# EAGLE design untitled (EAGLE 6.4)
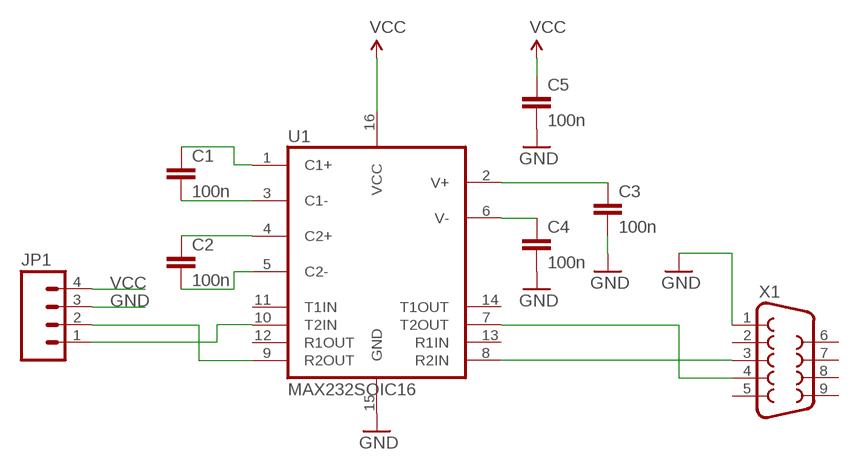
[diagram p0: schematic, sheet 1]

## Parts
C1  100n  CAP1206  [1206]
C2  100n  CAP1206  [1206]
C3  100n  CAP1206  [1206]
C4  100n  CAP1206  [1206]
C5  100n  CAP1206  [1206]
JP1  M04PTH  [1X04]
U1  MAX232SOIC16  [SO016]
X1  DB9FEMALE  [DB9]

## Nets
GND: C3.2 C4.2 C5.2 JP1.3 U1.15(GND) X1.1
N$1: C1.1 U1.1(C1+)
N$2: C1.2 U1.3(C1-)
N$3: C2.1 U1.4(C2+)
N$4: C2.2 U1.5(C2-)
N$5: C3.1 U1.2(V+)
N$6: C4.1 U1.6(V-)
N$7: U1.8(R2IN) X1.3
N$8: U1.7(T2OUT) X1.4
N$9: JP1.2 U1.9(R2OUT)
N$10: JP1.1 U1.10(T2IN)
VCC: C5.1 JP1.4 U1.16(VCC)
Unconnected: U1.11(T1IN) U1.12(R1OUT) U1.13(R1IN) U1.14(T1OUT) X1.2 X1.5 X1.6 X1.7 X1.8 X1.9

## Library data of the parts
C1-C5 = SparkFun-Capacitors:CAP: Capacitor Standard 0603 ceramic capacitor, and 0.1" leaded capacitor.
JP1 = SparkFun-Connectors:M04: Header 4 Standard 4-pin 0.1" header. Use with straight break away headers (SKU : PRT-00116), right angle break away headers (PRT-00553), swiss pins (PRT-00743), machine pins (PRT-00117), and female headers (PRT-00115). Molex polarized connector foot print use with SKU : PRT-08231 with associated crimp pins and housings. 1MM SMD Version SKU: PRT-10208
U1 = SparkFun-DigitalIC:MAX232: RS232 Transceiver Very common IC. This is generically called 'MAX232', but works with the 3V equivalent MAX3232 generic ICs. Field tested and mother approved. Spark Fun Electronics SKU : COM-00316 (DIP) and COM-00589 (SMD)
X1 = SparkFun-Connectors:DB9: DB9 Connector Standard DB9 (D-Sub 9) serial connector. Can be used for CAN bus as well as RS485 and RS232. Footprint production proven. Spark Fun Electronics SKU : PRT-00429

## Board
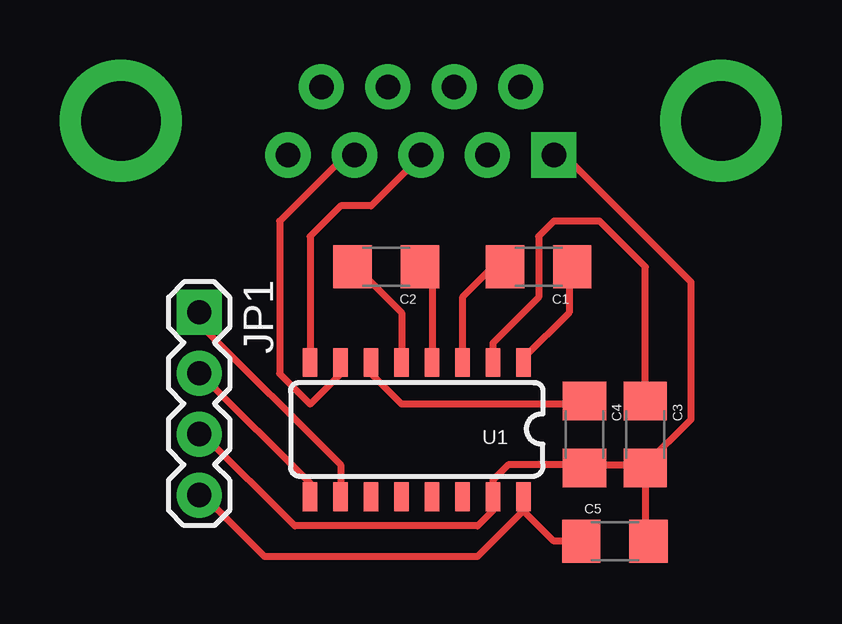
[diagram p1: board, top side]
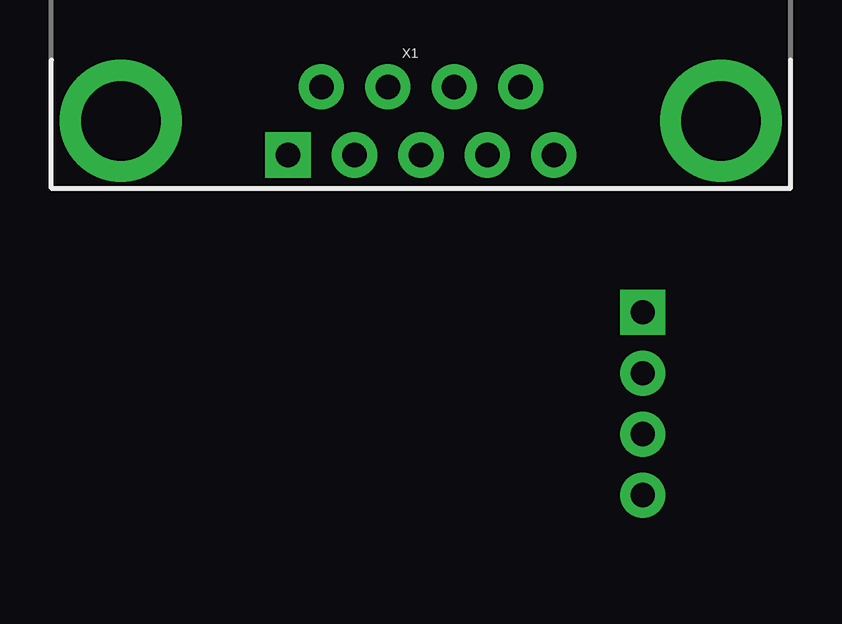
[diagram p2: board, bottom side, seen from below]

No outline drawn. Coordinates in mm, seen from the top.
Copper layers (1*16): Top 0.035mm / dielectric 1.5mm / Bottom 0.035mm
Design rules "default-1": minimum track width 0.3mm, minimum drill 0.8mm, track to track 0.4mm, track to pad 0.4mm, pad to pad 0.4mm, via to via 12mil, smd to smd 8mil, copper to edge 0mil, drill to drill 0.8mm, minimum pad ring 0.2mm, minimum via ring 12mil, stop-mask expansion 4mil, vias tented up to drill 0mil, thermal gap 0.8mm

### Footprints (pad centres in the part's own frame; a part is rotated, then mirrored left to right if it is on the bottom)
1206 = smd 1.6 x 1.8: 1 -1.4,0; 2 1.4,0
1X04 = drill 1.016 pad 1.88 square: 1 0,0 | drill 1.016 pad 1.88: 2 2.54,0; 3 5.08,0; 4 7.62,0
SO016 = smd 0.6 x 1.2: 1 -4.445,-2.8; 2 -3.175,-2.8; 3 -1.905,-2.8; 4 -0.635,-2.8; 5 0.635,-2.8; 6 1.905,-2.8; 7 3.175,-2.8; 8 4.445,-2.8; 9 4.445,2.8; 10 3.175,2.8; 11 1.905,2.8; 12 0.635,2.8; 13 -0.635,2.8; 14 -1.905,2.8; 15 -3.175,2.8; 16 -4.445,2.8
DB9 = drill 1.016 pad 1.88 square: 1 -5.54,-1.42 | drill 1.016 pad 1.88: 2 -2.77,-1.42; 3 0,-1.42; 4 2.77,-1.42; 5 5.54,-1.42; 6 -4.15,1.42; 7 -1.38,1.42; 8 1.38,1.42; 9 4.15,1.42 | drill 3.302 pad 5.08: G1 -12.5,0; G2 12.5,0

### Placement (x,y rotation side)
C1  52.07,57.15 180 top
C2  45.72,57.15 180 top
C3  56.52,50.16 270 top
C4  53.98,50.16 270 top
C5  55.24,45.72 0 top
JP1  37.92,55.26 270 top
U1  46.99,50.37 180 top
X1  47.16,63.23 0 bottom

### Tracks (layer width: path | path; a pad name or v marks a point on that pad's centre or on a via)
GND
  Top 0.3: 53.98,48.9 50.8,48.9 50.16,48.26 U1.15 50.16,46.99 49.53,46.35 41.91,46.35 38.1,50.16 JP1.3 | 53.98,48.9 56.52,48.9 | 53.98,48.9 C4.2 | C5.2 56.52,45.72 C3.2 56.52,48.9 | 56.52,48.9 58.42,50.8 58.42,56.52 53.09,61.85 52.7,61.85 X1.1 52.7,61.59
N$1
  Top 0.3: U1.1 51.44,53.34 53.34,55.24 53.34,57.15 C1.1
N$2
  Top 0.3: U1.3 48.9,55.88 50.16,57.15 C1.2
N$3
  Top 0.3: U1.4 47.62,57.15 C2.1
N$4
  Top 0.3: U1.5 46.35,55.24 44.45,57.15 C2.2
N$5
  Top 0.3: U1.2 50.16,53.98 52.07,55.88 52.07,58.42 52.7,59.05 54.61,59.05 56.52,57.15 C3.1
N$6
  Top 0.3: U1.6 45.09,52.7 46.35,51.44 53.98,51.44 C4.1
N$7
  Top 0.3: U1.8 42.55,58.42 43.81,59.69 45.09,59.69 46.99,61.59 X1.3
N$8
  Top 0.3: U1.7 43.81,52.7 42.55,51.44 41.27,52.7 41.27,59.05 43.81,61.59 X1.4
N$9
  Top 0.3: U1.9 42.55,48.13 38.1,52.58 JP1.2
N$10
  Top 0.3: U1.10 43.81,48.9 37.97,54.74 37.97,54.61 38.1,55.24 JP1.1
VCC
  Top 0.3: 51.44,46.99 52.7,45.72 C5.1 | 51.44,46.99 49.53,45.09 40.64,45.09 38.1,47.62 JP1.4 | 51.44,46.99 U1.16